# Altium project Good Night.PrjPcb
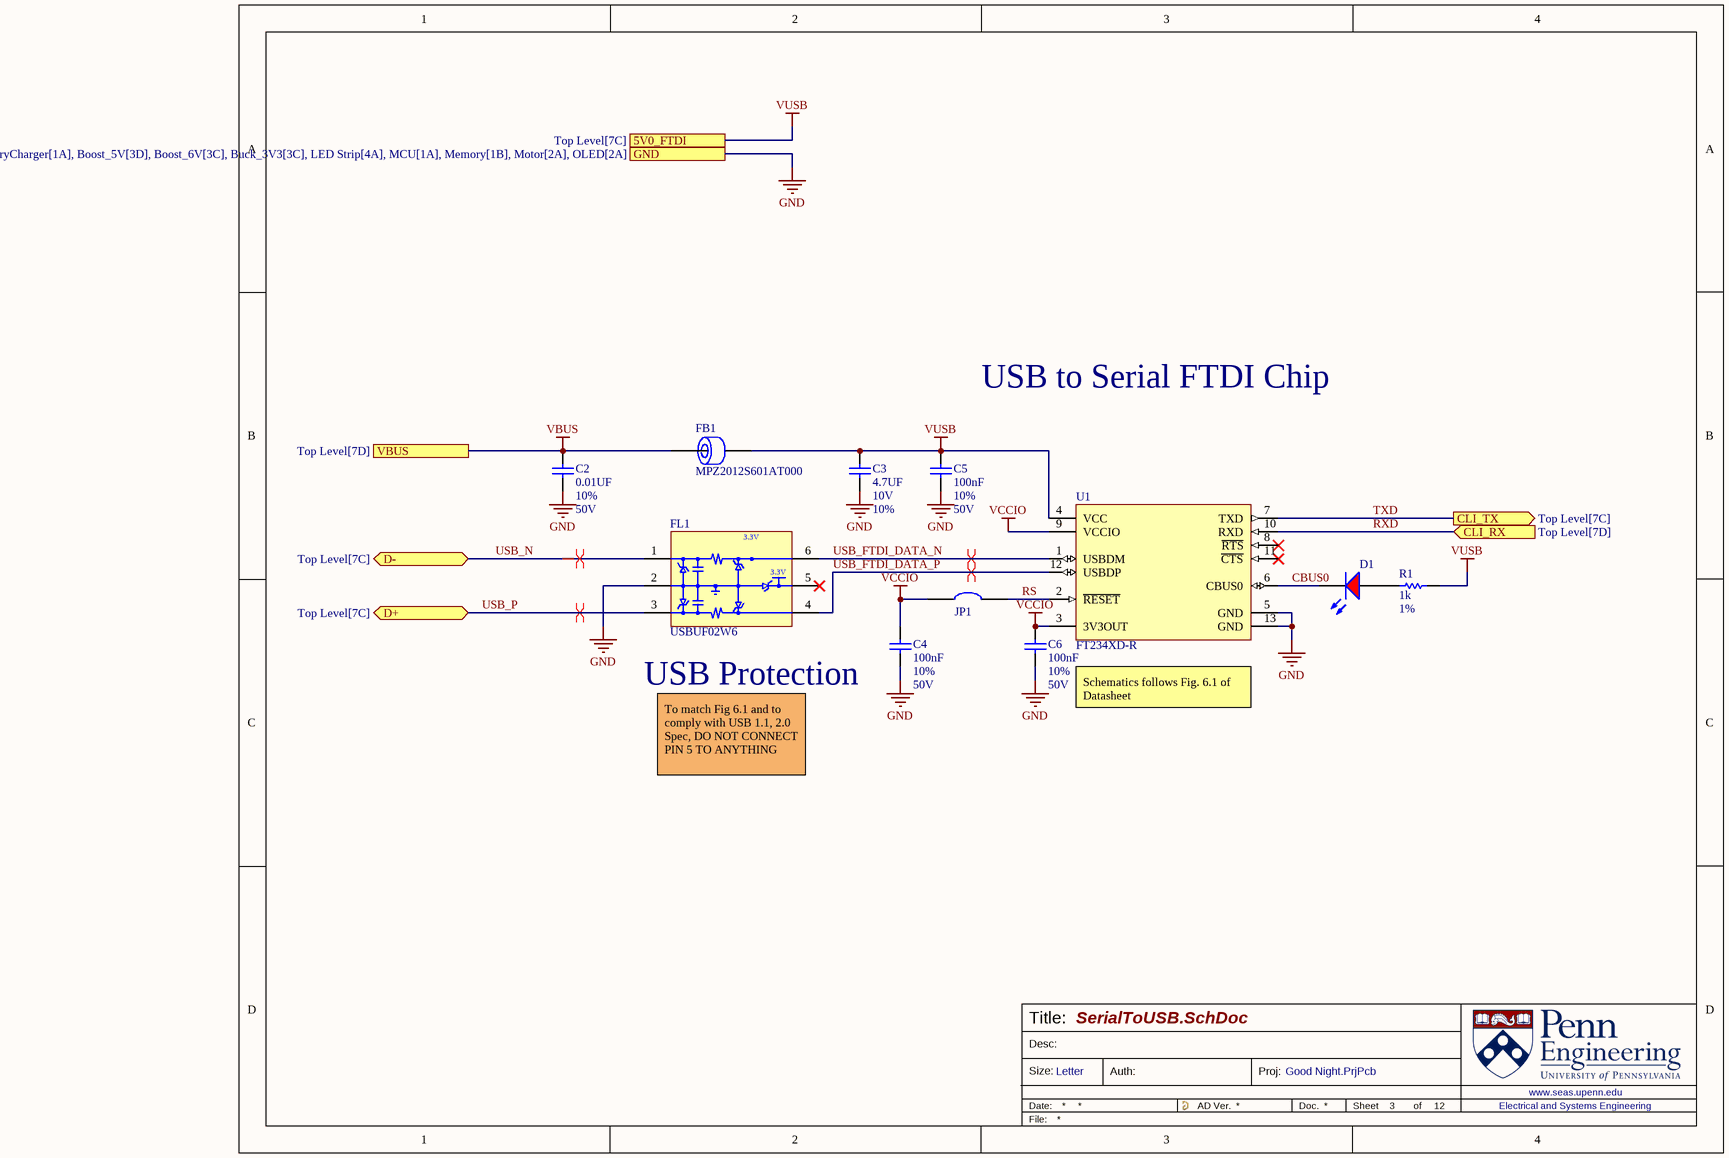
[diagram p0: SerialToUSB.SchDoc]

5 sheets, 76 parts. Net scope: strictly hierarchical (ports join the sheet entries above them; power ports are local).
Board file: PCB_V1.PcbDoc
Sheets:
  SerialToUSB.SchDoc
  BatteryCharger.SchDoc
  MCU.SchDoc
  Motor.SchDoc
  Boost_6V.SchDoc

## Sheet SerialToUSB.SchDoc
size Letter; CompanyName: Penn Electric Racing; Organization: Penn Electric Racing; Address1: 220 S. 33rd St; Address2: Towne Bldg, B11; Address3: Philadelpia, PA 19104; Address4: USA; SheetNumber: 3; SheetTotal: 12

### Parts
C2  value 0.01UF  Tolerance: 10%  Voltage: 50V  [0603_CAP]  (hidden comment: CAP 0603 0.01UF 50V 10% X7R)
C3  value 4.7UF  Voltage: 10V  Tolerance: 10%  [0805_CAP]  (hidden comment: CAP 0805 4.7UF 10V 10% X7R)
C4  value 100nF  Tolerance: 10%  Voltage: 50V  [0603_CAP]  (hidden comment: CAP 0603 0.1UF 50V 10% X7R)
C5  value 100nF  Tolerance: 10%  Voltage: 50V  [0603_CAP]  (hidden comment: CAP 0603 0.1UF 50V 10% X7R)
C6  value 100nF  Tolerance: 10%  Voltage: 50V  [0603_CAP]  (hidden comment: CAP 0603 0.1UF 50V 10% X7R)
D1  LSM0805412V  [LED_0805_RED]  (value not drawn)
FB1  MPZ2012S601AT000  [FP-MPZ2012-MFG (0805)]
FL1  USBUF02W6  [SOT-363-6-ST]
JP1  0603 link  [0603_JP_RES]  (value not drawn)
R1  value 1k  Tolerance: 1%  [0603_RES]  (hidden comment: RES 0603 1K 1%)
U1  FT234XD-R  [FP-DFN-12-MFG]

### Ports
5V0_FTDI (see Top Level[7C]), CLI_RX (in, see Top Level[7D]), CLI_TX (out, see Top Level[7C]), D+ (bidir, see Top Level[7C]), D- (bidir, see Top Level[7C]), GND (see Top Level[7C], AI_Audio_Module[4A], BatteryCharger[1A], Boost_5V[3D], Boost_6V[3C], Buck_3V3[3C], LED Strip[4A], MCU[1A], Memory[1B], Motor[2A], OLED[2A]), VBUS (see Top Level[7D])

### Nets
GND: C2.1 C3.1 C4.1 C5.1 C6.1 FL1.2(GND) U1.5(GND) U1.13(GND) ; port GND
VBUS: C2.2 FB1.1 ; port VBUS
VCCIO: C4.2 C6.2 JP1.1 U1.3(3V3OUT) U1.9(VCCIO)
VUSB: C3.2 C5.2 FB1.2 R1.2 U1.4(VCC) ; port 5V0_FTDI
CBUS0: D1.K U1.6(CBUS0)  [project net CBUS0_3]
RS: JP1.2 U1.2(~{RESET})  [project net RS_3]
RXD: U1.10(RXD) ; port CLI_RX
TXD: U1.7(TXD) ; port CLI_TX
USB_FTDI_DATA_N: FL1.6(D4) U1.1(USBDM)  [project net USB_FTDI_DATA_N_3]
USB_FTDI_DATA_P: FL1.4(D3) U1.12(USBDP)  [project net USB_FTDI_DATA_P_3]
USB_N: FL1.1(D1) ; port D-
USB_P: FL1.3(D2) ; port D+
NetD1_A: D1.A R1.1

Not connected (* = marked no-connect by the designer): FL1 5(3.3_V)*; U1 8(~{RTS})* 11(~{CTS})*

### Layout directives
differential pair; differential pair class USB; net class USB: USB_FTDI_DATA_N_3, USB_FTDI_DATA_P_3
differential pair: USB_N, USB_P

### Notes on the sheet
- USB to Serial FTDI Chip
- (near C4) USB Protection
- Schematics follows Fig. 6.1 of Datasheet
- To match Fig 6.1 and to comply with USB 1.1, 2.0 Spec, DO NOT CONNECT PIN 5 TO ANYTHING
- Title:
- Desc:
- Size:
- Letter
- Auth:
- Proj:
- Sheet
- of
- www.seas.upenn.edu
- Electrical and Systems Engineering

### Library data of the parts
C2 = CMP-011-000188-2: Capacitor Surface Mount 0603 Footprint 0.01UF 50V 10% Tolerance Ceramic X7R; Manufacturer: Various; Description in Visual: Cap SMT 0603 0.01UF 50V 10%  Cer X7R; PCB Package: 0603; Mount: SMT; JLCPCB Part #: C57112; Manufacturer P/N: CAP 0603 0.01UF 50V 10% X7R; P/N: CAP 0603 0.01UF 50V 10% X7R; Type: Ceramic X7R
C3 = CMP-011-000522-1: Capacitor Surface Mount 0805 Footprint 4.7UF 10V 10% Tolerance Ceramic X7R; Manufacturer: Various; PCB Package: 0805; Description in Visual: Cap SMT 0805 4.7UF 10V 10%  Cer X7R; P/N: CAP 0805 4.7UF 10V 10% X7R; Type: Ceramic X7R; Manufacturer P/N: CAP 0805 4.7UF 10V 10% X7R; Mount: SMT
C4-C6 = CMP-011-000223-3: Capacitor Surface Mount 0603 Footprint 0.1UF 50V 10% Tolerance Ceramic X7R 100nF; Manufacturer: Various; PCB Package: 0603; Description in Visual: Cap SMT 0603 0.1UF 50V 10%  Cer X7R; JLCPCB Part #: C14663; Mount: SMT; Type: Ceramic X7R; Manufacturer P/N: CAP 0603 0.1UF 50V 10% X7R; P/N: CAP 0603 0.1UF 50V 10% X7R; Capacitor Type: Ceramic; Case/Package: 0603; RoHS: Yes
D1 = CMP-00026-00001-2: Single Color LED, RED, 0805; Test Current: 20mA; Forward Voltage: 2V; Wavelength - Peak: 625nm; RoHS Compliant: Yes; Current: 20mA; Color: Red; Wavelength - Dominant: 625nm
FB1 = CMP-00563-1: 600 Ohms @ 100 MHz 1 Power Line Ferrite Bead 0805 (2012 Metric) 2A 100mOhm
FL1 = CMP-00571-2: Terminator, 2-Line, PDSO6; RC (Pi) EMI Filter 2nd Order Low Pass 2 Channel R = 22Ohms, C = 47pF 6-TSSOP, SC-88, SOT-363, USB 1.1; Nominal Supply Voltage: 3.3V; Interface IC Type: OTHER TERMINATOR; Number of Signal Positions: 2; Differential Output: Yes; Package Equivalence Code: TSSOP6,.08; Qualification Status: Not Qualified; Package Body Material: Plastic; Channels: 1; Width: 1.25mm; Height - Seated (Max): 1.1mm; Surface Mount: Yes; Peak Reflow Temperature (Cel): 260°C; JESD-30 Code: R-PDSO-G6; Length: 2mm; Case/Package: TSSOP; Package Shape: Rectangular; Min Operating Temperature: -40°C; Power Supplies: 3.3V; Temperature Grade: OTHER; Reach SVHC Compliant: Yes; Moisture Sensitivity Level: 1; Pins: 6; Terminal Finish: Tin; RoHS Compliant: Yes; Max Operating Temperature: 70°C; JESD-609 Code: e3; Terminal Position: DUAL; Terminal Form: Gull Wing; Package Style: SMALL OUTLINE, THIN PROFILE, SHRINK PITCHMeter; Terminal Pitch: 0.65mm
JP1 = CMP-00422-5: 0O link, SMD, 0603, Solder Bridge Option; Manufacturer P/N: Various; Manufacturer: Generic; Description in Visual: 0O link, Solder Bridge/SMD, Open; Value: 0.025; Source: Shunts and Jumpers.SchLib; Pin Count: 2; Design Item ID: 0603 link; Component Type: Net Tie; P/N: 0603 link
R1 = CMP-005-002503-3: Resistor Surface Mount, 1K Ohms, 0603 Footprint, 1% Tolerance 0.1W; Manufacturer: Various; PCB Package: 0603; Description in Visual: Res SMT 1K 0603  1%  0.1W; JLCPCB Part #: C21190; Power Rating: 0.1W; Manufacturer P/N: RES 0603 1K 1%; Mount: SMT
U1 = CMP-00104-3: USB Bridge, USB to UART USB 2.0 UART Interface 12-DFN (3x3); Nominal Supply Voltage: 5V; Qualification Status: Not Qualified; Package Body Material: Plastic; Time @ Peak Reflow Temperature-Max (s): 40s; Min Supply Voltage: 2.97V; Max Supply Voltage: 5.5V; Power Supplies: 1.8/3.3,3.3/5V; Package Style: SMALL OUTLINE, HEAT SINK/SLUG, THIN PROFILEMeter; Technology: CMOS; Terminal Pitch: 0.45mm; Terminal Position: DUAL; Moisture Sensitivity Level: 3; Reach SVHC Compliant: Yes; Length: 3mm; Package Shape: Square; Pins: 12; RoHS Compliant: Yes; Temperature Grade: INDUSTRIAL; Min Operating Temperature: -40°C; Peak Reflow Temperature (Cel): 260°C; Surface Mount: Yes; Terminal Form: No Lead; Max Operating Temperature: 85°C; Case/Package: HTSON; Width: 3mm

## Sheet BatteryCharger.SchDoc
size Letter; CompanyName: Penn Electric Racing; Organization: Penn Electric Racing; Address1: 220 S. 33rd St; Address2: Towne Bldg, B11; Address3: Philadelpia, PA 19104; Address4: USA; SheetNumber: 4; SheetTotal: 12
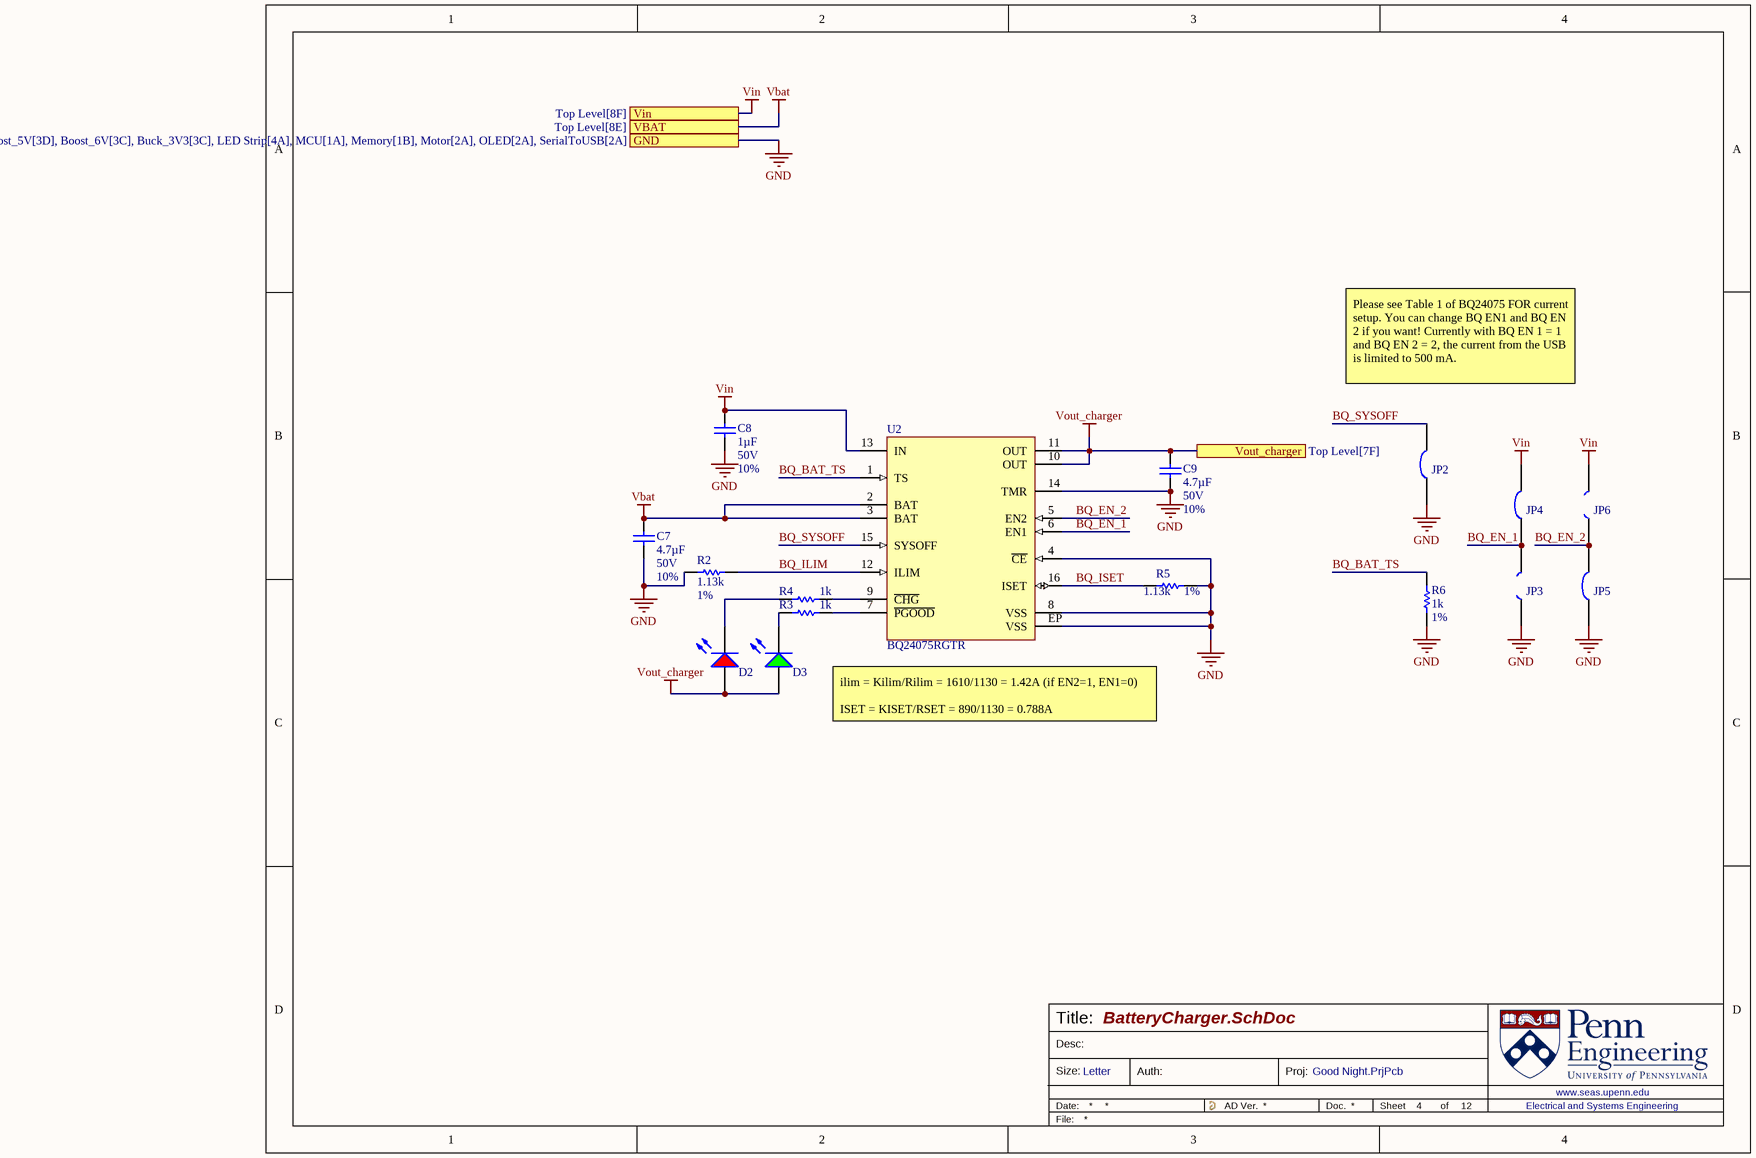
[diagram p1: BatteryCharger.SchDoc]

### Parts
C7  value 4.7µF  Voltage: 50V  Tolerance: 10%  [0805_CAP]  (hidden comment: CAP 0805 4.7UF 50V 10% X5R)
C8  value 1µF  Voltage: 50V  Tolerance: 10%  [0603_CAP]  (hidden comment: CAP 0603 1UF 50V 10% X7R)
C9  value 4.7µF  Voltage: 50V  Tolerance: 10%  [0805_CAP]  (hidden comment: CAP 0805 4.7UF 50V 10% X5R)
D2  LSM0805412V  [LED_0805_RED]  (value not drawn)
D3  LSM0805452V  [LED_0805]  (value not drawn)
JP2  0603 link  [0603_JP_RES]  (value not drawn)
JP3  0603 link (Open)  [0603_JP_Open]  (value not drawn)  (no BOM)
JP4  0603 link  [0603_JP_RES]  (value not drawn)
JP5  0603 link  [0603_JP_RES]  (value not drawn)
JP6  0603 link (Open)  [0603_JP_Open]  (value not drawn)  (no BOM)
R2  value 1.13k  Tolerance: 1%  [0603_RES]  (hidden comment: RES 0603 1.13K 1%)
R3  value 1k  [0603_RES]  (hidden comment: RES 0603 1K 1%)
R4  value 1k  [0603_RES]  (hidden comment: RES 0603 1K 1%)
R5  value 1.13k  Tolerance: 1%  [0603_RES]  (hidden comment: RES 0603 1.13K 1%)
R6  value 1k  Tolerance: 1%  [0603_RES]  (hidden comment: RES 0603 1K 1%)
U2  BQ24075RGTR  [FP-RGT0016C-IPC_A]

### Ports
GND (see Top Level[8E], AI_Audio_Module[4A], Boost_5V[3D], Boost_6V[3C], Buck_3V3[3C], LED Strip[4A], MCU[1A], Memory[1B], Motor[2A], OLED[2A], SerialToUSB[2A]), VBAT (see Top Level[8E]), Vin (see Top Level[8F]), Vout_charger (see Top Level[7F])

### Nets
GND: C7.1 C8.1 C9.1 JP2.1 JP3.1 JP5.2 R2.1 R5.2 R6.1 U2.4(~{CE}) U2.8(VSS) U2.14(TMR) U2.EP(VSS) ; port GND
Vbat: C7.2 U2.2(BAT) U2.3(BAT) ; port VBAT
Vin: C8.2 JP4.2 JP6.1 U2.13(IN) ; port Vin
Vout_charger: C9.2 D2.A D3.A U2.10(OUT) U2.11(OUT) ; port Vout_charger
BQ_BAT_TS: R6.2 U2.1(TS)  [project net BQ_BAT_TS_4]
BQ_EN_1: JP3.2 JP4.1 U2.6(EN1)  [project net BQ_EN_1_4]
BQ_EN_2: JP5.1 JP6.2 U2.5(EN2)  [project net BQ_EN_2_4]
BQ_ILIM: R2.2 U2.12(ILIM)  [project net BQ_ILIM_4]
BQ_ISET: R5.1 U2.16(ISET)  [project net BQ_ISET_4]
BQ_SYSOFF: JP2.2 U2.15(SYSOFF)  [project net BQ_SYSOFF_4]
NetD2_K: D2.K R4.2
NetD3_K: D3.K R3.2
NetR3_1: R3.1 U2.7(~{PGOOD})
NetR4_1: R4.1 U2.9(~{CHG})

### Notes on the sheet
- Please see Table 1 of BQ24075 FOR current setup. You can change BQ EN1 and BQ EN 2 if you want! Currently with BQ EN 1 = 1 and BQ EN 2 = 2, the current from the USB is limited to 500 mA.
- ilim = Kilim/Rilim = 1610/1130 = 1.42A (if EN2=1, EN1=0)
  ISET = KISET/RSET = 890/1130 = 0.788A
- Title:
- Desc:
- Size:
- Letter
- Auth:
- Proj:
- Sheet
- of
- www.seas.upenn.edu
- Electrical and Systems Engineering

### Library data of the parts
C7 C9 = CMP-001-00021-2: Capacitor Surface Mount 0805 Footprint 4.7UF 50V 10% Tolerance Ceramic X5R; P/N: CAP 0805 4.7UF 35V 10% X5R; Description in Visual: Cap SMT 0805 4.7UF 35V 10%  Cer X5R; PCB Package: 0805; RoHS: Yes; Type: Ceramic X5R; Mount: SMT; Capacitor Type: Ceramic; Pins: 2; Case/Package: 0805
C8 = CMP-011-000287-2: Capacitor Surface Mount 0603 Footprint 1UF 50V 10% Tolerance Ceramic X7R; Manufacturer: Various; Description in Visual: Cap SMT 0603 1UF 50V 10% Ceramic X7R; PCB Package: 0603; Manufacturer P/N: CAP 0603 1UF 50V 10% X7R; P/N: CAP 0603 1UF 50V 10% X7R; Type: Ceramic X7R; Mount: SMT; Capacitor Type: Ceramic; Case/Package: 0603; RoHS: Yes
D2 = CMP-00026-00001-2: as D1 on sheet SerialToUSB; RoHS Compliant: Yes; Current: 20mA; Color: Red; Wavelength - Dominant: 625nm
D3 = CMP-00038-4: Single Color LED, Green, 0805; Test Current: 20mA; Forward Voltage: 2V; Wavelength - Peak: 571nm; Package (Case): 0805; RoHS Compliant: Yes; Current: 20mA; Wavelength - Dominant: 571nm; Color: Green
JP2 JP4 JP5 = CMP-00422-5: as JP1 on sheet SerialToUSB; Source: Shunts and Jumpers.SchLib; Pin Count: 2; Design Item ID: 0603 link; Component Type: Net Tie; P/N: 0603 link
JP3 JP6 = CMP-00423-2: 0O link, Solder Bridge/SMD, Open; Value: 10000000000meg; P/N: 0603 link (Open); Description in Visual: 0O link, Solder Bridge/SMD, Open; Component Type: Standard (No BOM); Design Item ID: 0603 link (Open); Pin Count: 2; Source: Shunts and Jumpers.SchLib
R2 R5 = CMP-005-001984-2: Resistor Surface Mount, 1.13K Ohms, 0603 Footprint, 1% Tolerance 0.1W; Manufacturer: Various; Description in Visual: Res SMT 1.13K 0603  1%  0.1W; PCB Package: 0603; Power Rating: 0.1W; Manufacturer P/N: RES 0603 1.13K 1%; Mount: SMT
R3 R4 R6 = CMP-005-002503-3: as R1 on sheet SerialToUSB; JLCPCB Part #: C21190; Power Rating: 0.1W; Manufacturer P/N: RES 0603 1K 1%; Mount: SMT
  R3 R4: Tolerance: 1%
U2 = CMP-00080-5: Power Supply Support Circuit, Adjustable, 1 Channel, 6.6, PQCC16; Nominal Supply Voltage: 5V; Channels: 1; Min Supply Voltage: 4.35V; Qualification Status: Not Qualified; Power Supplies: 4.5/6.3V; Package Equivalence Code: LCC16,.12SQ,20; Adjustable Threshold: Yes; Package Body Material: Plastic; Max Supply Voltage: 26V; Supply Current-Max (Isup): 1.5mA; Reach SVHC Compliant: Yes; RoHS Compliant: Yes; Throw Configuration: POWER SUPPLY SUPPORT CIRCUIT; Moisture Sensitivity Level: 2; Min Operating Temperature: -40°C; JESD-609 Code: e4; Width: 3mm; Terminal Form: No Lead; Terminal Finish: Nickel; Terminal Position: QUAD; Height - Seated (Max): 1mm; Temperature Grade: INDUSTRIAL; Case/Package: HVQCCN; Length: 3mm; Max Operating Temperature: 85°C; Peak Reflow Temperature (Cel): 260°C; Number of Channels: 1; Package Shape: Square; Package Style: CHIP CARRIER, HEAT SINK/SLUG, VERY THIN PROFILEMeter; Surface Mount: Yes; Pins: 16; JESD-30 Code: S-PQCC-N16; Terminal Pitch: 0.5mm

## Sheet MCU.SchDoc
size Legal; CompanyName: Penn Electric Racing; Organization: Penn Electric Racing; Address1: 220 S. 33rd St; Address2: Towne Bldg, B11; Address3: Philadelpia, PA 19104; Address4: USA; SheetNumber: 5; SheetTotal: 12
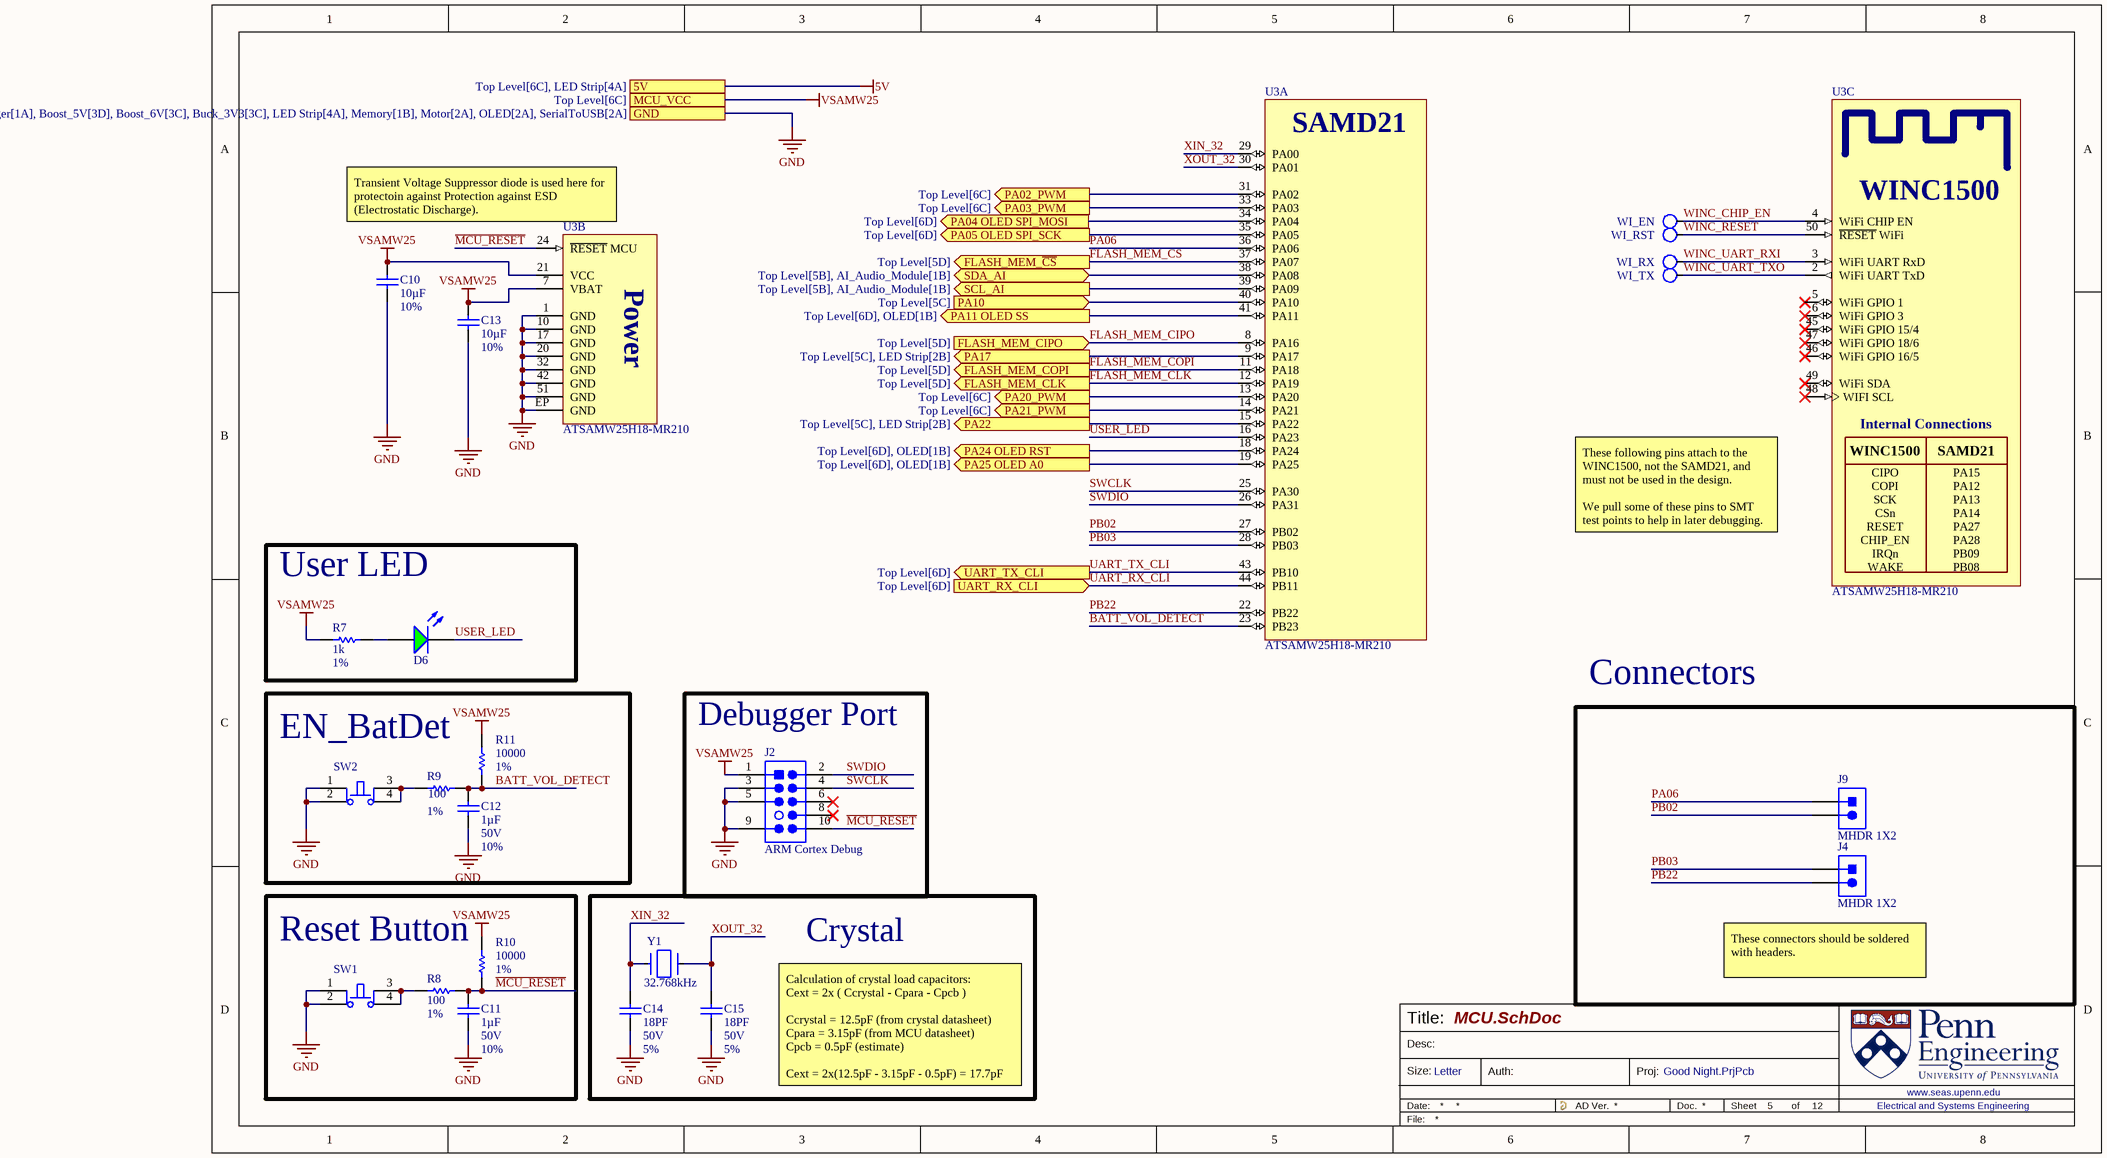
[diagram p2: MCU.SchDoc]

### Parts
C10  value 10µF  Tolerance: 10%  [1206_CAP]  (hidden comment: CAP 1206 10UF 50V 10% X5R)
C11  value 1µF  Voltage: 50V  Tolerance: 10%  [0603_CAP]  (hidden comment: CAP 0603 1UF 50V 10% X7R)
C12  value 1µF  Voltage: 50V  Tolerance: 10%  [0603_CAP]  (hidden comment: CAP 0603 1UF 50V 10% X7R)
C13  value 10µF  Tolerance: 10%  [1206_CAP]  (hidden comment: CAP 1206 10UF 50V 10% X5R)
C14  value 18PF  Voltage: 50V  Tolerance: 5%  [0603_CAP]  (hidden comment: CAP 0603 18PF 50V 5% C0G)
C15  value 18PF  Voltage: 50V  Tolerance: 5%  [0603_CAP]  (hidden comment: CAP 0603 18PF 50V 5% C0G)
D6  LSM0805452V  [LED_0805]  (value not drawn)
J2  ARM Cortex Debug  [FTSH-105-01-F-DV-007-K PLUGIN]
J4  MHDR 1X2  [PH1-02-UA]
J9  MHDR 1X2  [PH1-02-UA]
R7  value 1k  Tolerance: 1%  [0603_RES]  (hidden comment: RES 0603 1K 1%)
R8  value 100  Tolerance: 1%  [0603_RES]  (hidden comment: RES 0603 100 1%)
R9  value 100  Tolerance: 1%  [0603_RES]  (hidden comment: RES 0603 100 1%)
R10  value 10000  Tolerance: 1%  [0603_RES]  (hidden comment: RES 0603 10K 1%)
R11  value 10000  Tolerance: 1%  [0603_RES]  (hidden comment: RES 0603 10K 1%)
SW1  PTS810SJK250SMTRLFS  [PTS810SJK250SMTRLFS-Footprint-1]  (value not drawn)
SW2  PTS810SJK250SMTRLFS  [PTS810SJK250SMTRLFS-Footprint-1]  (value not drawn)
TP2  NetName: WI_TX  [SMT Testpoint, 50mil]  (hidden comment: Testpad)  (no BOM)
TP3  NetName: WI_RX  [SMT Testpoint, 50mil]  (hidden comment: Testpad)  (no BOM)
TP4  NetName: WI_RST  [SMT Testpoint, 50mil]  (hidden comment: Testpad)  (no BOM)
TP5  NetName: WI_EN  [SMT Testpoint, 50mil]  (hidden comment: Testpad)  (no BOM)
U3  ATSAMW25H18-MR210  [ATSAMW25H18-MR210-Footprint-1]  (parts A,B,C of 3)
Y1  Frequency: 32.768kHz  [FP-ABS07-MFG]  (hidden comment: ABS07-32.768KHZ-T)

### Blocks framed on the sheet
User LED: D6 R7
EN_BatDet: C12 R9 R11 SW2
Debugger Port: J2
Connectors: J4 J9
Reset Button: C11 R8 R10 SW1
Crystal: C14 C15 Y1

### Ports
5V (see Top Level[6C], LED Strip[4A]), FLASH_MEM_CIPO (in, see Top Level[5D]), FLASH_MEM_CLK (out, see Top Level[5D]), FLASH_MEM_COPI (out, see Top Level[5D]), FLASH_MEM_~{CS} (out, see Top Level[5D]), GND (see Top Level[6C], AI_Audio_Module[4A], BatteryCharger[1A], Boost_5V[3D], Boost_6V[3C], Buck_3V3[3C], LED Strip[4A], Memory[1B], Motor[2A], OLED[2A], SerialToUSB[2A]), MCU_VCC (see Top Level[6C]), PA02_PWM (out, see Top Level[6C]), PA03_PWM (out, see Top Level[6C]), PA04 OLED SPI_MOSI (out, see Top Level[6D]), PA05 OLED SPI_SCK (out, see Top Level[6D]), PA10 (in, see Top Level[5C]), PA11 OLED SS (out, see Top Level[6D], OLED[1B]), PA17 (out, see Top Level[5C], LED Strip[2B]), PA20_PWM (out, see Top Level[6C]), PA21_PWM (out, see Top Level[6C]), PA22 (out, see Top Level[5C], LED Strip[2B]), PA24 OLED RST (out, see Top Level[6D], OLED[1B]), PA25 OLED A0 (out, see Top Level[6D], OLED[1B]), SCL_AI (out, see Top Level[5B], AI_Audio_Module[1B]), SDA_AI (bidir, see Top Level[5B], AI_Audio_Module[1B]), UART_RX_CLI (in, see Top Level[6D]), UART_TX_CLI (out, see Top Level[6D])

### Nets
5V: port 5V
GND: C10.1 C11.1 C12.1 C13.1 C14.1 C15.1 J2.3 J2.5 J2.9 SW1.1 SW1.2 SW2.1 SW2.2 U3.1(GND) U3.10(GND) U3.17(GND) U3.20(GND) U3.32(GND) U3.42(GND) U3.51(GND) U3.EP(GND) ; port GND
VSAMW25: C10.2 C13.2 J2.1 R7.1 R10.2 R11.2 U3.7(VBAT) U3.21(VCC) ; port MCU_VCC
BATT_VOL_DETECT: C12.2 R9.2 R11.1 U3.23(PB23)  [project net BATT_VOL_DETECT_5]
FLASH_MEM_~{CS}: U3.37(PA07) ; port FLASH_MEM_~{CS}
FLASH_MEM_CIPO: U3.8(PA16) ; port FLASH_MEM_CIPO
FLASH_MEM_CLK: U3.12(PA19) ; port FLASH_MEM_CLK
FLASH_MEM_COPI: U3.11(PA18) ; port FLASH_MEM_COPI
~{MCU_RESET}: C11.2 J2.10 R8.2 R10.1 U3.24(~{RESET}_MCU)  [project net ~{MCU_RESET}_5]
PA02_PWM: U3.31(PA02) ; port PA02_PWM
PA03_PWM: U3.33(PA03) ; port PA03_PWM
PA04 OLED SPI_MOSI: U3.34(PA04) ; port PA04 OLED SPI_MOSI
PA05 OLED SPI_SCK: U3.35(PA05) ; port PA05 OLED SPI_SCK
PA06: J9.1 U3.36(PA06)  [project net PA06_5]
PA10: U3.40(PA10) ; port PA10
PA11 OLED SS: U3.41(PA11) ; port PA11 OLED SS
PA17: U3.9(PA17) ; port PA17
PA20_PWM: U3.13(PA20) ; port PA20_PWM
PA21_PWM: U3.14(PA21) ; port PA21_PWM
PA22: U3.15(PA22) ; port PA22
PA24 OLED RST: U3.18(PA24) ; port PA24 OLED RST
PA25 OLED A0: U3.19(PA25) ; port PA25 OLED A0
PB02: J9.2 U3.27(PB02)  [project net PB02_5]
PB03: J4.1 U3.28(PB03)  [project net PB03_5]
PB22: J4.2 U3.22(PB22)  [project net PB22_5]
SCL_AI: U3.39(PA09) ; port SCL_AI
SDA_AI: U3.38(PA08) ; port SDA_AI
SWCLK: J2.4 U3.25(PA30)  [project net SWCLK_5]
SWDIO: J2.2 U3.26(PA31)  [project net SWDIO_5]
UART_RX_CLI: U3.44(PB11) ; port UART_RX_CLI
UART_TX_CLI: U3.43(PB10) ; port UART_TX_CLI
USER_LED: D6.K U3.16(PA23)  [project net USER_LED_5]
WINC_CHIP_EN: TP5.1 U3.4(WiFi_CHIP_EN)  [project net WINC_CHIP_EN_5]
WINC_RESET: TP4.1 U3.50(~{RESET}_WiFi)  [project net WINC_RESET_5]
WINC_UART_RXI: TP3.1 U3.3(WiFi_UART_RxD)  [project net WINC_UART_RXI_5]
WINC_UART_TXO: TP2.1 U3.2(WiFi_UART_TxD)  [project net WINC_UART_TXO_5]
XIN_32: C14.2 U3.29(PA00) Y1.1  [project net XIN_32_5]
XOUT_32: C15.2 U3.30(PA01) Y1.2  [project net XOUT_32_5]
NetD6_A: D6.A R7.2
NetR8_1: R8.1 SW1.3 SW1.4
NetR9_1: R9.1 SW2.3 SW2.4

Not connected (* = marked no-connect by the designer): J2 6* 8*; U3 5(WiFi_GPIO_1)* 6(WiFi_GPIO_3)* 45(WiFi_GPIO_15/4)* 46(WiFi_GPIO_16/5)* 47(WiFi_GPIO_18/6)* 48(WIFI_SCL)* 49(WiFi_SDA)*

### Notes on the sheet
- (near U3) Transient Voltage Suppressor diode is used here for protectoin against Protection against ESD (Electrostatic Discharge).
- These following pins attach to the WINC1500, not the SAMD21, and must not be used in the design.
  We pull some of these pins to SMT test points to help in later debugging.
- (near J4) These connectors should be soldered with headers.
- Calculation of crystal load capacitors:
  Cext = 2x ( Ccrystal - Cpara - Cpcb )
  Ccrystal = 12.5pF (from crystal datasheet)
  Cpara = 3.15pF (from MCU datasheet)
  Cpcb = 0.5pF (estimate)
  Cext = 2x(12.5pF - 3.15pF - 0.5pF) = 17.7pF
- Title:
- Desc:
- Size:
- Letter
- Auth:
- Proj:
- Sheet
- of
- www.seas.upenn.edu
- Electrical and Systems Engineering
- (in symbol CMP-00071-11, part A) SAMD21
- (in symbol CMP-00071-11, part B) Power
- (in symbol CMP-00071-11, part C) WINC1500; Internal Connections; SAMD21; CIPO / COPI / SCK / CSn / RESET / CHIP_EN / IRQn / WAKE; PA15 / PA12 / PA13 / PA14 / PA27 / PA28 / PB09 / PB08

### Library data of the parts
C10 C13 = CMP-001-00003-5: Capacitor Surface Mount 1206 Footprint 10UF 25V 10% Tolerance Ceramic X5R; Manufacturer: Various; Description in Visual: Cap SMT 1206 10UF 50V 10%  Cer X5R; PCB Package: 1206; JLCPCB Part #: C13585; Type: Ceramic X5R; Mount: SMT; RoHS: Yes; P/N: CAP 1206 10UF 50V 10% X5R; Case/Package: 1206; Capacitor Type: Ceramic; Manufacturer P/N: CAP 1206 10UF 50V 10% X5R; Voltage: 50V
C11 C12 = CMP-011-000287-2: as C8 on sheet BatteryCharger; Manufacturer P/N: CAP 0603 1UF 50V 10% X7R; P/N: CAP 0603 1UF 50V 10% X7R; Type: Ceramic X7R; Mount: SMT; Capacitor Type: Ceramic; Case/Package: 0603; RoHS: Yes
C14 C15 = CMP-011-000283-1: Capacitor Surface Mount 0603 Footprint 18PF 50V 5% Tolerance Ceramic C0G; Manufacturer: Various; Description in Visual: Cap SMT 0603 18PF 50V 5%  Cer C0G; PCB Package: 0603; Type: Ceramic C0G; Manufacturer P/N: CAP 0603 18PF 50V 5% C0G; P/N: CAP 0603 18PF 50V 5% C0G; Mount: SMT
D6 = CMP-00038-4: as D3 on sheet BatteryCharger; RoHS Compliant: Yes; Current: 20mA; Wavelength - Dominant: 571nm; Color: Green
J2 = CMP-002-000013-2: 10 Pin Shrouded Header, 0.050", Key Pin 7; Manufacturer P/N: Various; Manufacturer: Samtech; Gender: Male; Number of Contacts: 10; ComponentLink1URL: https://developer.arm.com/documentation/ka001776/1-0/?lang=en; Description in Visual: 10 Pin Shrouded Header, 0.050", Key Pin 7; P/N: ARM Cortex Debug; Number of Rows: 2; Contact Finish: Gold; ComponentLink1Description: Pinout Reference; ComponentLink2URL: http://suddendocs.samtec.com/catalog_english/ftsh_smt.pdf; Pitch: 0.050"; Orientation: Vertical; ComponentLink2Description: Datasheet for Connector
J4 J9 = CMP-000021-1: Header, 2-Pin, 0.1in Pitch, Male
R7 = CMP-005-002503-3: as R1 on sheet SerialToUSB; JLCPCB Part #: C21190; Power Rating: 0.1W; Manufacturer P/N: RES 0603 1K 1%; Mount: SMT
R8 R9 = CMP-005-002125-2: Resistor Surface Mount, 100 Ohms, 0603 Footprint, 1% Tolerance 0.1W; Manufacturer P/N: RES 0603 100R 1%; Manufacturer: Various; Description in Visual: Res SMT 100 0603  1%  0.1W; PCB Package: 0603; Power Rating: 0.1W; Mount: SMT
R10 R11 = CMP-005-002156-3: Resistor Surface Mount, 10K Ohms, 0603 Footprint, 1% Tolerance 0.1W; Manufacturer: Various; Description in Visual: Res SMT 10K 0603  1%  0.1W; PCB Package: 0603; JLCPCB Part #: C25804; Manufacturer P/N: RES 0603 10K 1%; Power Rating: 0.1W; Mount: SMT
SW1 SW2 = CMP-00084-6: Keypad Switch, 1 Switches, SPST, Momentary tactile button, 0.05A, 16VDC, 3.23N, Solder Terminal, Surface Mount-straight; Manufacturer Series: PTS810; Actuator Length: 0.028inch; Electrical Life: 50000Cycles; Contact Resistance: 0.5mR; Solderability: REFLOW; Actuator Travel: 0.1524mm; Actuator Color: White; Actuator Type: Pushbutton; Insulation Resistance: 100MR; Dielectric Withstand Volts: 250VACV; Switch Function: OFF-MOM; Reach SVHC Compliant: Yes; Terminal Finish: Silver; Switch Type: Keypad; Switch Action: MOMENTARY; RoHS Compliant: Yes; JESD-609 Code: e4; Max Operating Temperature: 85°C; Termination: Solder; Min Operating Temperature: -40°C; Mounting Technology: Surface Mount; Circuit: SPST; Type: Tactile
TP2-TP5 = CMP-00049-8: Test Pad/Point (Testpoint, Testpad), for probing
U3 = CMP-00071-11: WiFi 802.11b/g/n Transceiver Module 2.412GHz ~ 2.484GHz Integrated, Trace Surface Mount, Integrated SAMD21 Cortex M0+; FCC ID: 2ADHKSAMW25; MCU Chipset: ATSAMD21G18A
Y1 = CMP-078-000002-2: Parallel - Fundamental Quartz Crystal, 0.032768MHz Nom; ESR: 70kR; Frequency Tolerance: 20ppm; Load Capacitance: 12.5pF; Additional Feature: TAPE AND REEL; Drive Level: 0.5uW; Aging: 3 PPM/FIRST YEAR; Max Operating Temperature: 85°C; Crystal/Resonator Type: PARALLEL - FUNDAMENTAL; Min Operating Temperature: -40°C; RoHS Compliant: Yes; Mounting Technology: Surface Mount; Reach SVHC Compliant: Yes; Operating Frequency-Nom: 0.032768

## Sheet Motor.SchDoc
size Legal; SheetNumber: 6; SheetTotal: 12
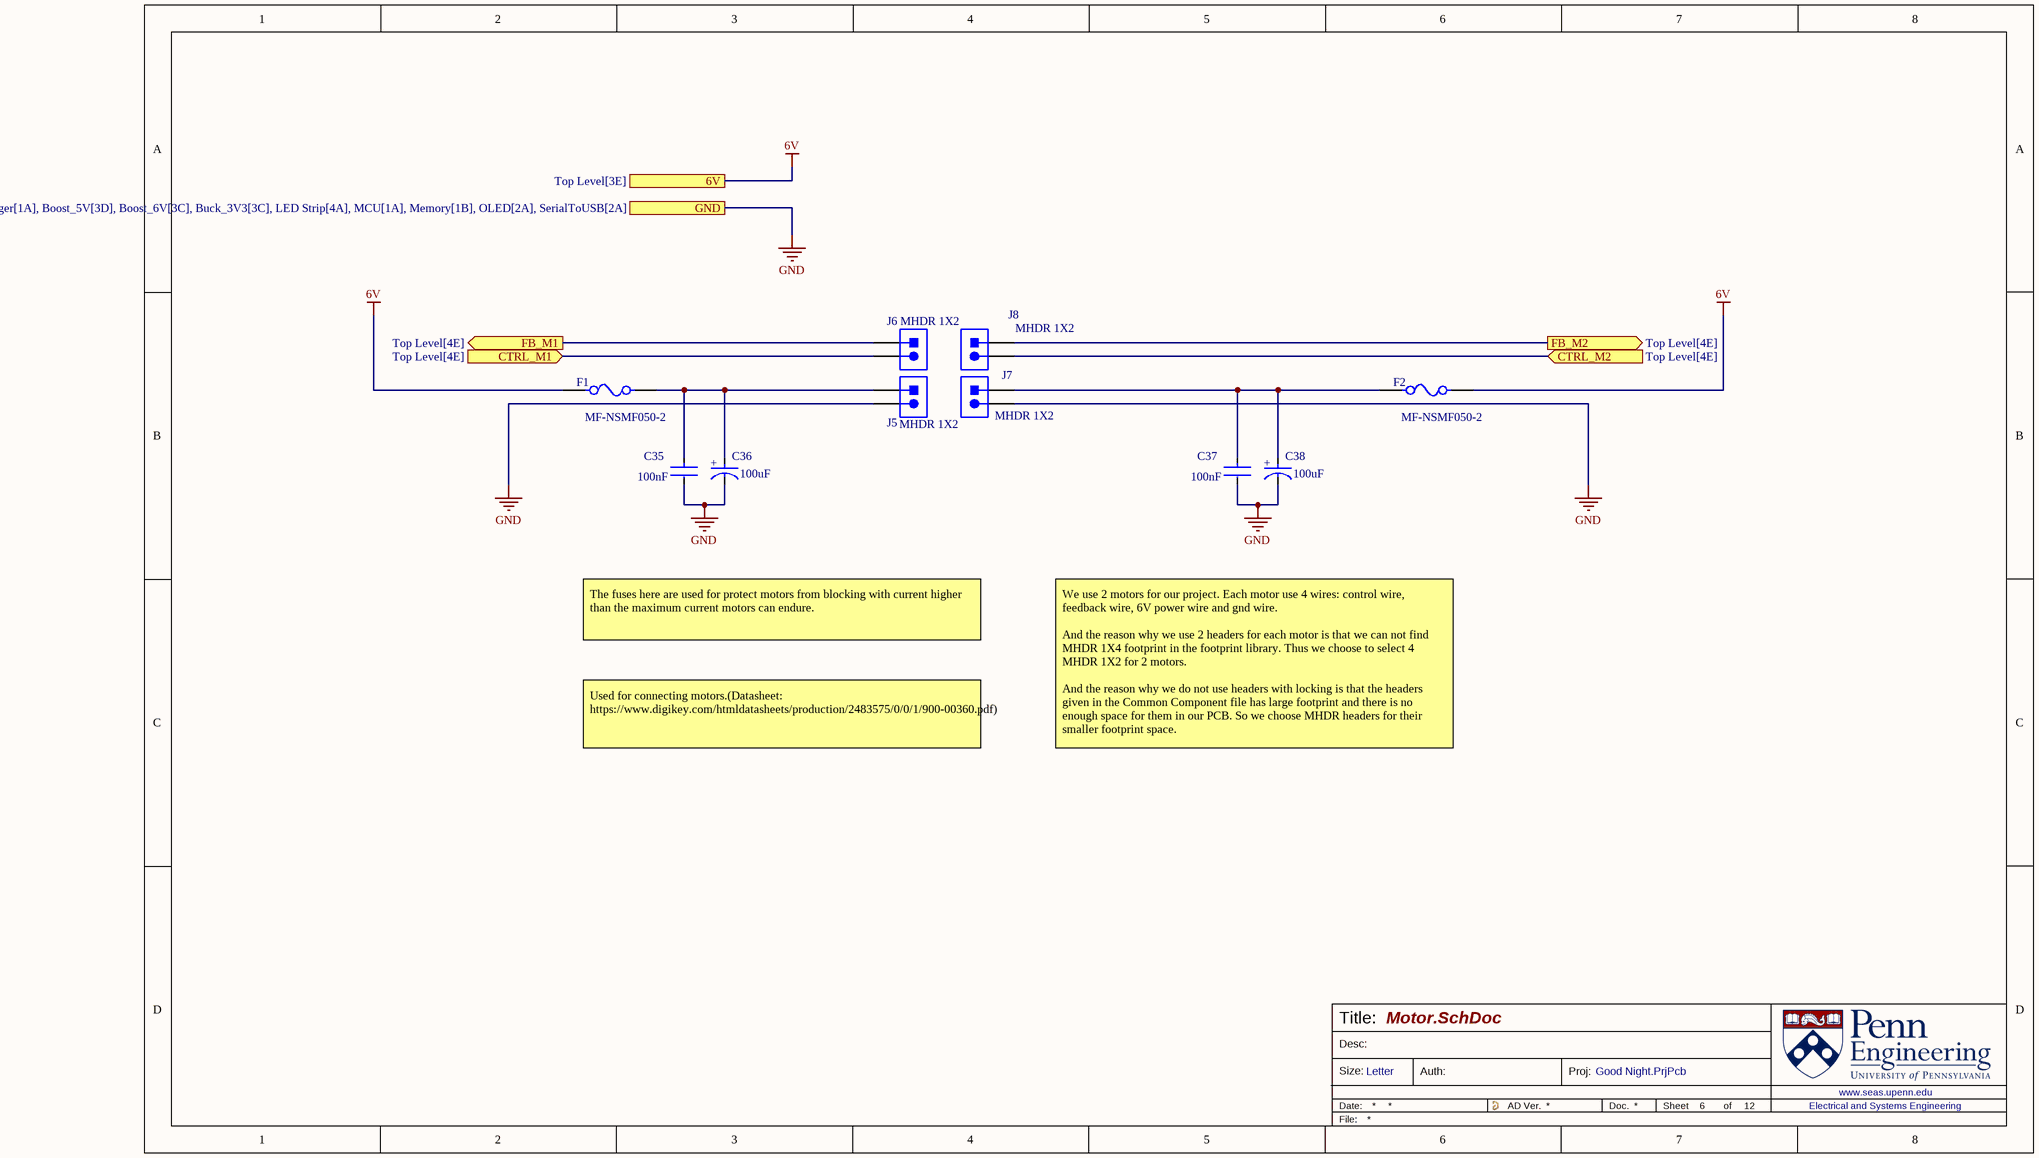
[diagram p3: Motor.SchDoc]

### Parts
C35  100nF  [FP-CC0603-DA-MFG]
C36  100uF  [FP-RAD-TH-D_8_0_5-L_11_5-MFG]
C37  100nF  [FP-CC0603-DA-MFG]
C38  100uF  [FP-RAD-TH-D_8_0_5-L_11_5-MFG]
F1  MF-NSMF050-2  [FP-MF-NSMF050-2-MFG]
F2  MF-NSMF050-2  [FP-MF-NSMF050-2-MFG]
J5  MHDR 1X2  [PH1-02-UA]
J6  MHDR 1X2  [PH1-02-UA]
J7  MHDR 1X2  [PH1-02-UA]
J8  MHDR 1X2  [PH1-02-UA]

### Ports
6V (see Top Level[3E]), CTRL_M1 (in, see Top Level[4E]), CTRL_M2 (in, see Top Level[4E]), FB_M1 (out, see Top Level[4E]), FB_M2 (out, see Top Level[4E]), GND (see Top Level[3E], AI_Audio_Module[4A], BatteryCharger[1A], Boost_5V[3D], Boost_6V[3C], Buck_3V3[3C], LED Strip[4A], MCU[1A], Memory[1B], OLED[2A], SerialToUSB[2A])

### Nets
6V: F1.1 F2.2 ; port 6V
GND: C35.2 C36.1(C) C37.2 C38.1(C) J5.2 J7.2 ; port GND
CTRL_M1: J6.2 ; port CTRL_M1
CTRL_M2: J8.2 ; port CTRL_M2
FB_M1: J6.1 ; port FB_M1
FB_M2: J8.1 ; port FB_M2
NetC35_1: C35.1 C36.2(A) F1.2 J5.1
NetC37_1: C37.1 C38.2(A) F2.1 J7.1

### Notes on the sheet
- The fuses here are used for protect motors from blocking with current higher than the maximum current motors can endure.
- Used for connecting motors.(Datasheet: https://www.digikey.com/htmldatasheets/production/2483575/0/0/1/900-00360.pdf)
- We use 2 motors for our project. Each motor use 4 wires: control wire, feedback wire, 6V power wire and gnd wire.
  And the reason why we use 2 headers for each motor is that we can not find MHDR 1X4 footprint in the footprint library. Thus we choose to select 4 MHDR 1X2 for 2 motors.
  And the reason why we do not use headers with locking is that the headers given in the Common Component file has large footprint and there is no enough space for them in our PCB. So we choose MHDR headers for their smaller footprint space.
- Title:
- Desc:
- Size:
- Letter
- Auth:
- Proj:
- Sheet
- of
- www.seas.upenn.edu
- Electrical and Systems Engineering
- (in symbol CMP-05427-002079-1) +

### Library data of the parts
C35 C37 = CMP-2000-05002-2: CAP CER 0.1UF 16V X7R 0603; Manufacturer Part Number: CC0603KRX7R7BB104; Manufacturer: YAGEO; Tolerance: 0.1; Temperature Coefficient: 15%; Material: Ceramic; Voltage Rating: 16 V; Package: CC0603-DA; ComponentLink2Description: Datasheet; Octopart: https://octopart.com/cc0603krx7r7bb104-yageo-192941; Temperature Range High: +125°C; Digikey Description: CAP CER 0.1UF 16V X7R 0603; Value: 100 nF; Voltage: 16 V; Device Class L2: Capacitors; Height: 0.9mm; Temperature: -55°C to +125°C; Device Class L1: Passive Components; Device Class L3: Ceramic Capacitors; ComponentLink2URL: http://www.yageo.com/documents/recent/UPY-GPHC_X7R_6.3V-to-50V_18.pdf; Footprint Url: http://www.yageo.com/exep/pages/download/literatures/UPY-C_GEN_24.pdf; RoHS: TRUE; Temperature Range Low: -55°C; Temperature Characteristic: X7R; Lead Free: Yes; Capacitance: 100 nF; Category: Cap; Mouser Description: Multilayer Ceramic Capacitor, CC Series, 0.1 - F, - 10%, X7R, 16 V, 0603 [1608 Metric]; Automotive: No
C36 C38 = CMP-05427-002079-1: Aluminum Electrolytic Capacitors (Radial Lead Type) 100uF ±20% 50V; ESR (Equivalent Series Resistance): 61mR; Lead Diameter: 0.6mm; Ripple Current (AC): 870mA; Life (Hours): 6000Hour; Lead/Base Style: Straight; Height - Seated (Max): 0.512inch; Height: 11.5mm; REACH SVHC: No SVHC; Contact Plating: Tin; Impedance: 61mR; Capacitance: 100uF; Voltage: 50V; Termination: Radial; Series: FR; Voltage Rating: 50V; Lead Pitch: 3.5mm; Diameter: 8mm; Number of Pins: 2; Min Operating Temperature: -40°C; Mount: Through Hole; Ripple Current: 870mA; Radiation Hardening: No; Length: 11.5mm; Max Operating Temperature: 105°C; Construction: RADIAL; Packaging: Bulk; Package Quantity: 200; Case/Package: Radial; RoHS Compliant: Yes; Voltage Rating (DC): 50V; Tolerance: 20%
F1 F2 = CMP-07400-000036-1: PTC RESET FUSE 13.2V 500MA 1206; Manufacturer: Bourns; Resistance: 0.15-0.7Ω; Hold Current: 0.5A; Trip Current: 1A; Current Rating: 100A; Value: 0.15-0.7Ω; Automotive Grade: Grade 3; Trip Time: 0.1s; Temperature Range Low: -40°C; Temperature: -40°C to +85°C; Digikey Description: PTC RESET FUSE 13.2V 500MA 1206; Ambient Temperature Range Low: -40°C; RoHS: TRUE; Device Class L2: PTC Resettable Fuses; Octopart: https://octopart.com/mf-nsmf050-2-bourns-34532; ComponentLink2Description: Datasheet; Voltage Rating: 13.2V; Category: Fuse; ComponentLink2URL: https://www.bourns.com/docs/product-datasheets/mfnsmf.pdf?sfvrsn=39c76af6_14; Mouser Description: Resettable Fuses - PPTC 0.50A 13.2V 0.15ohm 1206 Footprint; Temperature Range High: +85°C; Device Class L1: Circuit Protection; Device Class L3: unset; Automotive: Yes; Package: MF-NSMF050-2; Ambient Temperature Range High: +85°C; Height: 0.85mm; Manufacturer Part Number: MF-NSMF050-2; Lead Free: Yes
J5-J8 = CMP-000021-1: Header, 2-Pin, 0.1in Pitch, Male

## Sheet Boost_6V.SchDoc
size Letter; SheetNumber: 10; SheetTotal: 12
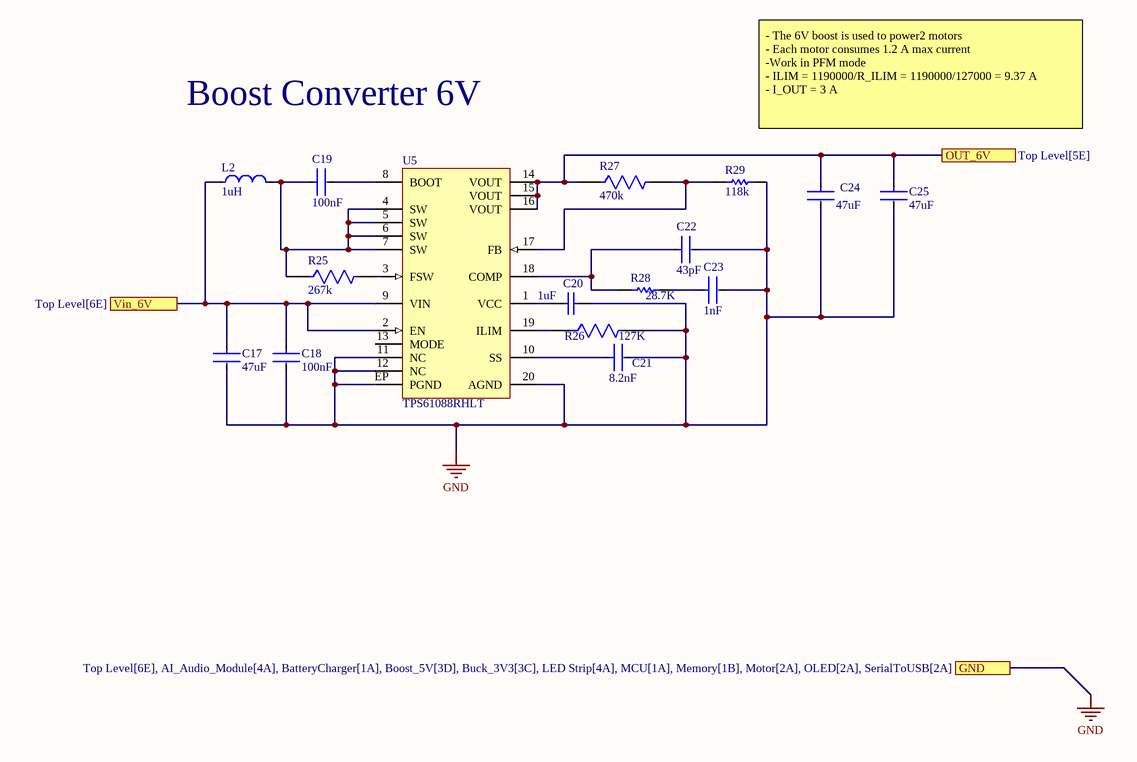
[diagram p4: Boost_6V.SchDoc]

### Parts
C17  47uF  [FP-C0805C476M9PACTU-MFG]
C18  100nF  [FP-CC0603-DA-MFG]
C19  100nF  [FP-CGA3E-0_3-0_1-IPC_A]
C20  1uF  [CAPC1608X87X35LL15T15]
C21  8.2nF  [FP-C0805C-DN-MFG]
C22  43pF  [FP-C0603C-CF-MFG]
C23  1nF  [FP-0603-L_1_6_0_15-W_0_81-IPC_A]
C24  47uF  [FP-C0805C476M9PACTU-MFG]
C25  47uF  [FP-C0805C476M9PACTU-MFG]
L2  1uH  [FP-LQW21HN_00-MFG]
R25  267k  [FP-RP732A-MFG]
R26  127K  [FP-CRCW0805-e3-MFG]
R27  470k  [FP-CRGCQ0805-IPC_C]
R28  28.7K  [RESC1609X50X30NL10T20]
R29  118k  [RESC2013X70X40NL20T20]
U5  TPS61088RHLT  [FP-RHL0020A-MFG]

### Ports
GND (see Top Level[6E], AI_Audio_Module[4A], BatteryCharger[1A], Boost_5V[3D], Buck_3V3[3C], LED Strip[4A], MCU[1A], Memory[1B], Motor[2A], OLED[2A], SerialToUSB[2A]), OUT_6V (see Top Level[5E]), Vin_6V (see Top Level[6E])

### Nets
GND: C17.2 C18.2 C20.2 C21.2 C22.2 C23.2 C24.2 C25.2 R26.2 R29.2 U5.11(NC) U5.12(NC) U5.20(AGND) U5.EP(PGND) ; port GND
OUT_6V: C24.1 C25.1 R27.1 U5.14(VOUT) U5.15(VOUT) U5.16(VOUT) ; port OUT_6V
Vin_6V: C17.1 C18.1 L2.1 U5.2(EN) U5.9(VIN) ; port Vin_6V
NetC19_1: C19.1 L2.2 R25.1 U5.4(SW) U5.5(SW) U5.6(SW) U5.7(SW)
NetC19_2: C19.2 U5.8(BOOT)
NetC20_1: C20.1 U5.1(VCC)
NetC21_1: C21.1 U5.10(SS)
NetC22_1: C22.1 R28.1 U5.18(COMP)
NetC23_1: C23.1 R28.2
NetR25_2: R25.2 U5.3(FSW)
NetR26_1: R26.1 U5.19(ILIM)
NetR27_2: R27.2 R29.1 U5.17(FB)

Not connected (* = marked no-connect by the designer): U5 13(MODE)

### Notes on the sheet
- Boost Converter 6V
- - The 6V boost is used to power2 motors
  - Each motor consumes 1.2 A max current
  -Work in PFM mode
  - ILIM = 1190000/R_ILIM = 1190000/127000 = 9.37 A
  - I_OUT = 3 A
- Title:
- Desc:
- Size:
- Letter
- Auth:
- Proj:
- Sheet
- of
- www.seas.upenn.edu
- Electrical and Systems Engineering

### Library data of the parts
C17 C24 C25 = CMP-2007-01008-2: CAP CER 47UF 6.3V X5R 0805; Dielectric Material: Ceramic; Dissipation Factor: 5%; Tolerance: 20%; Case Code (Imperial): 0805; Mount: PCB; Width: 1.2mm; Package Quantity: 3000; Radiation Hardening: No; Packaging: Tape and Reel; Termination: SMD/SMT; Series: C0805C; Voltage: 6.3V; Depth: 1.25mm; Dielectric: X5R; Case Code (Metric): 2012; Length: 2mm; Case/Package: 0805; REACH SVHC: No SVHC; Voltage Rating (DC): 6.3V; Capacitance: 47uF; RoHS Compliant: Yes; Height: 1.25mm; Construction: Flat; Number of Pins: 2; Voltage Rating: 6.3V; Max Operating Temperature: 85°C; Min Operating Temperature: -55°C
C18 = CMP-2000-05002-2: as C35 on sheet Motor; Voltage Rating: 16 V; Package: CC0603-DA; ComponentLink2Description: Datasheet; Octopart: https://octopart.com/cc0603krx7r7bb104-yageo-192941; Temperature Range High: +125°C; Digikey Description: CAP CER 0.1UF 16V X7R 0603; Value: 100 nF; Voltage: 16 V; Device Class L2: Capacitors; Height: 0.9mm; Temperature: -55°C to +125°C; Device Class L1: Passive Components; Device Class L3: Ceramic Capacitors; ComponentLink2URL: http://www.yageo.com/documents/recent/UPY-GPHC_X7R_6.3V-to-50V_18.pdf; Footprint Url: http://www.yageo.com/exep/pages/download/literatures/UPY-C_GEN_24.pdf; RoHS: TRUE; Temperature Range Low: -55°C; Temperature Characteristic: X7R; Lead Free: Yes; Capacitance: 100 nF; Category: Cap; Mouser Description: Multilayer Ceramic Capacitor, CC Series, 0.1 - F, - 10%, X7R, 16 V, 0603 [1608 Metric]; Automotive: No
C19 = CMP-2000-07546-2: Cap Ceramic 100nF 50V X7R 10% Pad SMD 0603 +125°C Automotive T/R; Weight: 7.1E-05oz; Composition: Ceramic; Max Operating Temperature: 125°C; Termination: SMD/SMT; Dielectric: X7R; Length: 1.6mm; Package Quantity: 1; REACH SVHC: No SVHC; Lead Free: Lead Free; Case Code (Metric): 1608; Min Operating Temperature: -55°C; Packaging: Tape and Reel; Tolerance: 10%; Voltage Rating: 50V; Case Code (Imperial): 0603; Capacitance: 100nF; Case/Package: 0603; Voltage Rating (DC): 50V; Depth: 0.8mm; Radiation Hardening: No; Ratings: AEC-Q200; Mount: Surface Mount; Voltage: 50V; Thickness: 0.035inch; Width: 0.8mm; Height: 0.8mm
C20 = CMP-2006-03713-1: Part Number: C0603C105K3RACTU; Manufacturer: Kemet
C21 = CMP-2007-03316-2: CAP CER 8200PF 200V C0G/NP0 0805; Manufacturer Part Number: C0805C822J2GACAUTO; Manufacturer: KEMET; Temperature Coefficient: 30ppm/°C; Material: Ceramic; Temperature Characteristic: C0G; Value: 8,200 pF; Tolerance: 0.05; ComponentLink2URL: https://content.kemet.com/datasheets/KEM_C1003_C0G_SMD.pdf; Digikey Description: CAP CER 8200PF 200V C0G/NP0 0805; Height: 0.88mm; Voltage Rating: 200 V; Temperature: -55°C to +125°C; RoHS: TRUE; Temperature Range Low: -55°C; Package: C0805C-DN; ComponentLink2Description: Datasheet; Device Class L2: Capacitors; Device Class L3: Ceramic Capacitors; Octopart: https://octopart.com/c0805c822j2gacauto-kemet-46733249; Automotive: No; Device Class L1: Passive Components; Category: Cap; Ipc Land Pattern Name: CAPC200125X78; Capacitance: 8,200 pF; Lead Free: Yes; Temperature Range High: +125°C
C22 = CMP-1035-01031-3: CAP CER 43PF 50V 5% NP0 0603; Manufacturer Part Number: C0603C430J5GACTU; Manufacturer: KEMET; Tolerance: 0.05; Automotive Grade: Grade 1; Material: Ceramic; Temperature Characteristic: C0G; Temperature Coefficient: 30ppm/°C; RoHS: TRUE; Height: 0.87mm; Octopart: https://octopart.com/c0603c430j5gactu-kemet-9138600; Device Class L2: Capacitors; Lead Free: Yes; Device Class L3: Ceramic Capacitors; ComponentLink2URL: https://api.kemet.com/component-edge/download/datasheet/C0603C100J5GACAUTO.pdf; Device Class L1: Passive Components; Digikey Description: CAP CER 43PF 50V 5% NP0 0603; Category: Cap; Temperature Range Low: -55°C; Value: 43 pF; ComponentLink2Description: Datasheet; Voltage Rating: 50 V; Mouser Description: Multilayer Ceramic Capacitor, C Series, 43 Pf, - 5%, C0g / Np0, 50 V, 0603 [1608 Metric] Rohs Compliant: Yes; Temperature Range High: +125°C; Package: C0603C-CF; Temperature: -55°C to +125°C; Capacitance: 43 pF; Automotive: Yes
C23 = CMP-2006-04378-2: General Purpose Ceramic Capacitor, 0603, 1nF, 10%, X7R, 15%, 50V; Case Code (Metric): 1608; Min Operating Temperature: -55°C; Weight: 7.1E-05oz; Series: -; Capacitance: 1nF; RoHS Compliant: Yes; Radiation Hardening: No; Height: 0.9mm; Mount: Surface Mount; REACH SVHC: No SVHC; Lead Free: Lead Free; Depth: 0.81mm; Voltage: 50V; Number of Pins: 2; Voltage Rating: 50V; Max Operating Temperature: 125°C; Termination: SMD/SMT; Construction: Flat; Case Code (Imperial): 0603; Dielectric: X7R; Width: 0.032inch; Tolerance: 10%; Case/Package: 0603; Contact Plating: Tin; Packaging: Tape and Reel; Voltage Rating (DC): 50V; Dielectric Material: Ceramic; Package Quantity: 4000; Thickness: 0.035inch; Length: 1.6mm
L2 = CMP-06042-000167-1: FIXED IND 1UH 115MA 2.86 OHM SMD; Q Factor: 35; Shielding: Unshielded; Self Resonant Frequency: 450MHz; Core Material: Ferrite; DC Resistance (DCR): 2.86R; Tolerance: 5%; Test Frequency: 10MHz; Resistor Type: Wirewound; DC Current: 115mA; Radiation Hardening: No; Length: 2mm; Packaging: Tape and Reel; Current Rating: 115mA; Weight: 0.000282oz; Case/Package: 0805; Case Code (Imperial): 0805; Case Code (Metric): 2012; Inductance: 1uH; Military Standard: Not; Depth: 1.4mm; Min Operating Temperature: -40°C; Mount: Surface Mount; Package Quantity: 3000; Termination: SMD/SMT; Height: 0.9mm; Max DC Current: 115mA; Max Operating Temperature: 85°C; Height - Seated (Max): 0.039inch; Lead Free: Lead Free; Width: 1.5mm
R25 = CMP-03211-008573-2: Surface Mount Resistors, Precision Resistor, 2 Terminations, Size Code 0805, Cut Tape Length, .1%, Thin Film, 10K 0.1% 10PPM; Voltage Rating: 150V; Number of Resistors: 1; Temperature Coefficient: 15ppm/°C; Power Rating: 125mW; Resistance: 267kR; Tolerance: 0.1%; Packaging: Tape and Reel; Min Operating Temperature: -55°C; Mount: Surface Mount; Termination: Solder; Length: 2mm; Case Code (Imperial): 0805; Package Quantity: 1000; Number of Terminations: 2; Case/Package: 0805; Case Code (Metric): 2012; Weight: 0.000194oz; Height: 0.55mm; Max Operating Temperature: 155°C; Width: 1.25mm; ELV: Compliant
R26 = CMP-2001-04290-2: RES Thick Film, 127kΩ, 1%, 0.125W, 100ppm/°C, 0805; Voltage Rating (DC): 150V; Max Power Dissipation: 125mW; Resistance: 127kR; Case Code (Metric): 2012; Length: 2mm; Packaging: Tape and Reel; Contact Plating: Tin; Height: 0.02inch; Features: Automotive AEC-Q200; Width: 1.25mm; Composition: Thick Film; Case/Package: 0805; Weight: 0.000194oz; Case Code (Imperial): 0805; Radiation Hardening: No; Number of Terminations: 2; Lead Free: Lead Free; Package Quantity: 10; Tolerance: 1%; Power Rating: 125mW; Voltage Rating: 150V; Number of Pins: 2; Military Standard: Not; Temperature Coefficient: 100ppm/°C; Max Operating Temperature: 155°C; Depth: 1.25mm; Min Operating Temperature: -55°C
R27 = CMP-03211-004111-1: CRGCQ0805 470KΩ 0.125W ±100ppm/°C 5% 150V; Manufacturer Part Number: CRGCQ0805J470K; Manufacturer: TE Connectivity; Tolerance: 0.05; Ambient Temperature Range High: +70°C; Power Rating: 0.125W; Lead Free: Yes; RoHS: TRUE; Height: 0.65mm; Ipc Land Pattern Name: RESC200125X55; Automotive Grade: Grade 1294; Category: Res; Device Class L2: Resistors; Temperature Range Low: -55°C; Series: CRGCQ; Octopart: https://octopart.com/crgcq0805j470k-te+connectivity-91018228; ComponentLink2Description: Datasheet; Package: CRGCQ0805; Device Class L1: Passive Components; Temperature Range High: +155°C; Voltage Rating: 150V; Device Class L3: Chip SMD Resistors; Value: 470KΩ; Automotive: Yes; Temperature Coefficient: ±100ppm/°C; ComponentLink2URL: https://www.te.com/commerce/DocumentDelivery/DDEController?Action=showdoc&DocId=Data+Sheet%7F1773204-3%7F1%7Fpdf%7FEnglish%7FENG_DS_1773204-3_1.pdf%7F4-2176341-1303; Temperature: -55°C to +155°C; Composition: Thick Film; Resistance: 470KΩ
R28 = CMP-2000-03154-1: Manufacturer: Vishay Dale; Part Number: CRCW060328K7FKEA
R29 = CMP-2001-04400-1: Part Number: ERJ-6ENF1183V; Manufacturer: Panasonic
U5 = CMP-00676-1: Switching Regulator, Current-mode, 13A, 2200kHz Switching Freq-Max, PQCC20; Control Technique: PULSE WIDTH MODULATION; Max Supply Voltage: 12V; Nominal Output Voltage: 9V; Min Input Voltage: 2.7V; Nominal Supply Voltage: 3.6V; Channels: 1; Frequency: 2.2MHz; Switcher Configuration: BOOST; Package Body Material: Plastic; RoHS Compliant: Yes; Terminal Position: QUAD; Surface Mount: Yes; Case/Package: HVQCCN; Height - Seated (Max): 1mm; JESD-609 Code: e4; Terminal Form: No Lead; Terminal Finish: Nickel; Package Style: CHIP CARRIER, HEAT SINK/SLUG, VERY THIN PROFILEMeter; Pins: 20; Length: 4.5mm; Control Mode: CURRENT-MODE; Moisture Sensitivity Level: 2; Throw Configuration: SWITCHING REGULATOR; Min Operating Temperature: -40°C; Reach SVHC Compliant: Yes; Temperature Grade: INDUSTRIAL; Width: 3.5mm; Max Operating Temperature: 85°C; Package Shape: Rectangular; Max Output current: 13A; Terminal Pitch: 0.5mm

## Assembly variants
Prototype Variant: not fitted C36 C38 J4 J5 J6 J7 J8 J9 J10 J11 J12 J13 J14 J15 J16 TP1 TP6 TP7 TP8 TP9 TP10 TP11 TP12 TP13 TP14 TP15 TP16 TP17 TP18 TP19 TP20 TP21 TP22 TP23 TP24 TP25
Unpopulated: not fitted C36 C38 J4 J5 J6 J7 J8 J9 J10 J11 J12 J13 J14 J15 J16 TP1 TP6 TP7 TP8 TP9 TP10 TP11 TP12 TP13 TP14 TP15 TP16 TP17 TP18 TP19 TP20 TP21 TP22 TP23 TP24 TP25